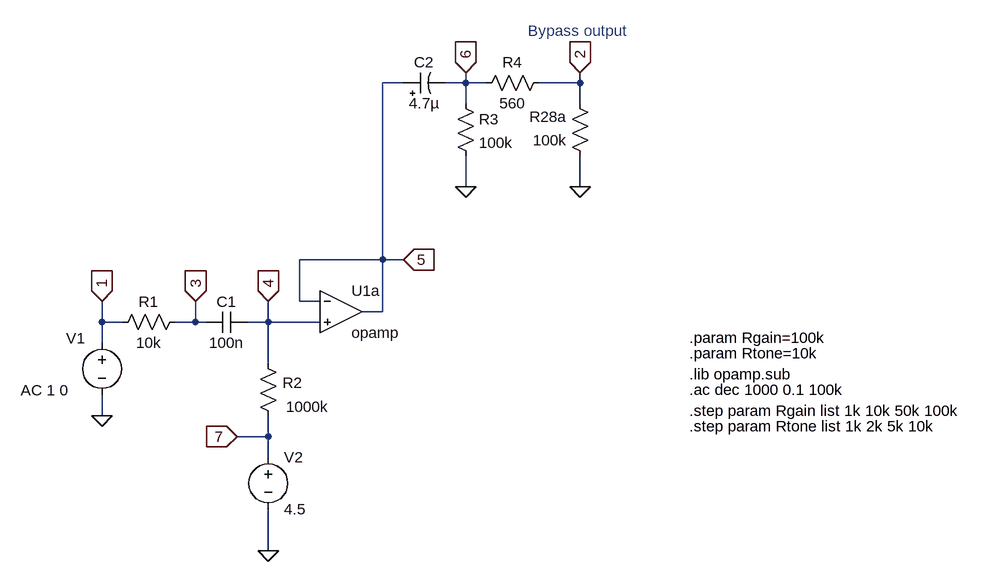
[diagram p0: schematic Klon-Centaur_bypass.asc]
Klon-Centaur_bypass.asc, the LTspice schematic file:
Version 4
SHEET 1 4496 5064
WIRE -320 2208 -352 2208
WIRE -224 2208 -224 2192
WIRE -224 2208 -256 2208
WIRE -192 2208 -224 2208
WIRE -48 2208 -48 2192
WIRE -48 2208 -112 2208
WIRE -224 2240 -224 2208
WIRE -48 2240 -48 2208
WIRE -224 2368 -224 2320
WIRE -48 2368 -48 2320
WIRE -352 2480 -352 2208
WIRE -352 2480 -480 2480
WIRE -320 2480 -352 2480
WIRE -480 2544 -480 2480
WIRE -448 2544 -480 2544
WIRE -352 2560 -352 2480
WIRE -352 2560 -384 2560
WIRE -784 2576 -784 2544
WIRE -752 2576 -784 2576
WIRE -640 2576 -640 2544
WIRE -640 2576 -672 2576
WIRE -624 2576 -640 2576
WIRE -528 2576 -528 2544
WIRE -528 2576 -560 2576
WIRE -448 2576 -528 2576
WIRE -784 2608 -784 2576
WIRE -528 2640 -528 2576
WIRE -784 2720 -784 2688
WIRE -528 2752 -528 2720
WIRE -528 2752 -576 2752
WIRE -528 2784 -528 2752
WIRE -528 2928 -528 2864
FLAG -784 2544 1
IOPIN -784 2544 In
FLAG -528 2928 0
FLAG -784 2720 0
FLAG -224 2368 0
FLAG -48 2368 0
FLAG -640 2544 3
IOPIN -640 2544 In
FLAG -528 2544 4
IOPIN -528 2544 In
FLAG -224 2192 6
IOPIN -224 2192 In
FLAG -48 2192 2
IOPIN -48 2192 In
FLAG -576 2752 7
IOPIN -576 2752 In
FLAG -320 2480 5
IOPIN -320 2480 In
SYMBOL voltage -784 2592 R0
WINDOW 0 -55 9 Left 2
WINDOW 123 -125 89 Left 2
WINDOW 39 0 0 Left 0
WINDOW 3 -289 58 Left 2
SYMATTR InstName V1
SYMATTR Value2 AC 1 0
SYMATTR Value ""
SYMBOL res -656 2560 R90
WINDOW 0 0 56 VBottom 2
WINDOW 3 32 56 VTop 2
SYMATTR InstName R1
SYMATTR Value 10k
SYMBOL res -512 2736 R180
WINDOW 0 -37 67 Left 2
WINDOW 3 -77 30 Left 2
SYMATTR InstName R2
SYMATTR Value 1000k
SYMBOL cap -560 2560 R90
WINDOW 0 0 32 VBottom 2
WINDOW 3 32 32 VTop 2
SYMATTR InstName C1
SYMATTR Value 100n
SYMBOL voltage -528 2768 R0
WINDOW 123 0 0 Left 0
WINDOW 39 0 0 Left 0
SYMATTR InstName V2
SYMATTR Value 4.5
SYMBOL OpAmps\\opamp -416 2496 R0
SYMATTR InstName U1a
SYMBOL res -240 2224 R0
SYMATTR InstName R3
SYMATTR Value 100k
SYMBOL res -96 2192 R90
WINDOW 0 0 56 VBottom 2
WINDOW 3 32 56 VTop 2
SYMATTR InstName R4
SYMATTR Value 560
SYMBOL res -32 2336 R180
WINDOW 0 36 76 Left 2
WINDOW 3 36 40 Left 2
SYMATTR InstName R28a
SYMATTR Value 100k
SYMBOL polcap -320 2224 R270
WINDOW 0 32 32 VTop 2
WINDOW 3 0 32 VBottom 2
SYMATTR InstName C2
SYMATTR Value 4.7µ
TEXT 120 2600 Left 2 !.param Rgain=100k
TEXT 120 2624 Left 2 !.param Rtone=10k
TEXT 120 2656 Left 2 !.lib opamp.sub
TEXT 120 2680 Left 2 !.ac dec 1000 0.1 100k
TEXT 120 2712 Left 2 !.step param Rgain list 1k 10k 50k 100k
TEXT 120 2736 Left 2 !.step param Rtone list 1k 2k 5k 10k
TEXT -128 2128 Left 2 ;Bypass output

The netlist it stands for:
* Klon-Centaur_bypass.asc
V1 1 0 AC 1 0
R1 3 1 10k
R2 7 4 1000k
C1 4 3 100n
V2 7 0 4.5
XU1a 5 4 5 opamp Aol=100K GBW=10Meg  ; pins invin noninvin out
R3 6 0 100k
R4 2 6 560
R28a 0 2 100k
C2 5 6 4.7µ
.param Rgain=100k
.param Rtone=10k
.lib opamp.sub
.ac dec 1000 0.1 100k
.step param Rgain list 1k 10k 50k 100k
.step param Rtone list 1k 2k 5k 10k
* Bypass output
.backanno
.end